# EasyEDA Pro project EasyEDApro.epro

# Schematic Main board
Create Date: 2023-11-24; Page Name: Sheet_1.1; Project Name: Outdoor Air Quality Sensor; Schematic Name: Main board; Update Date: 2023-11-24; Company: Robonomics.network; Drawed: ludovich88; Page Size: A3; Part Number: RN-AQ - 01; Reviewed: EnsRationis; Version: V1
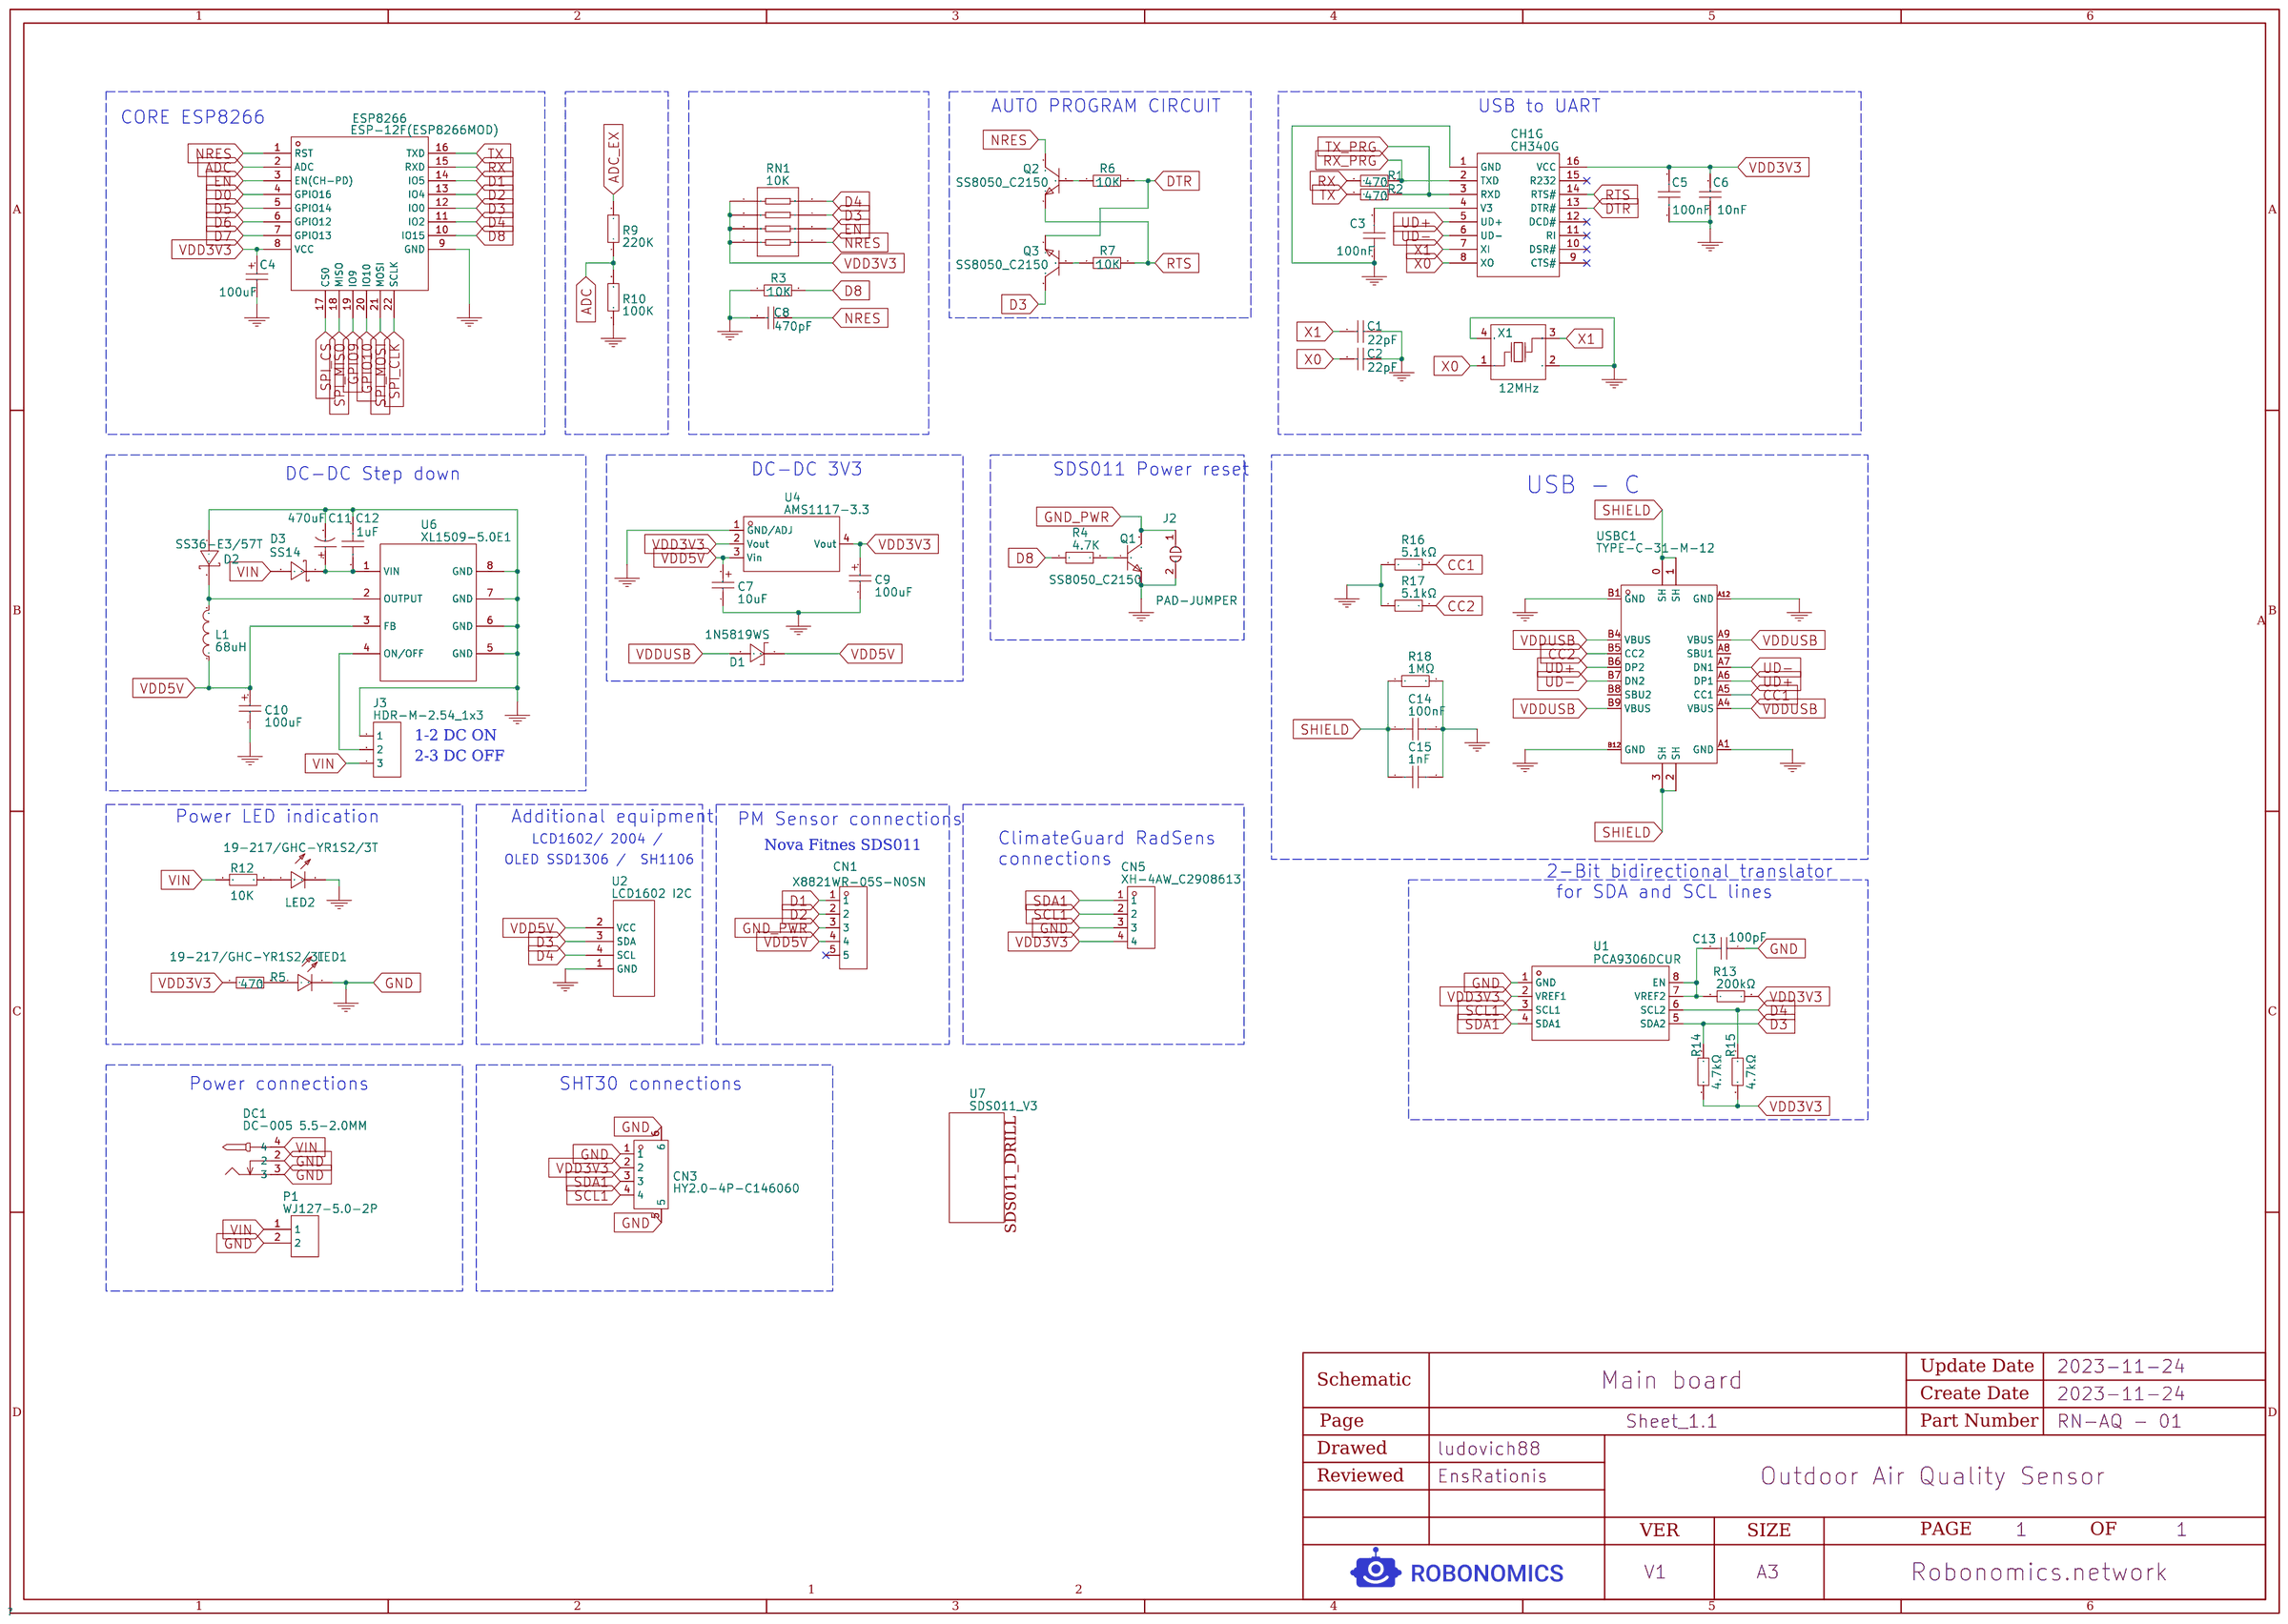
[diagram p0: schematic sheet]

## Parts
C1  22pF  [C0603]
C2  22pF  [C0603]
C3  100nF  [C0603]
C4  100uF  [CAP-SMD_L3.5-W2.8]
C5  100nF  [C0603]
C6  10nF  [C0603]
C7  10uF  [CAP-SMD_L3.2-W1.6-R-RD]
C8  470pF  [C0603]
C9  100uF  [CAP-SMD_L3.5-W2.8]
C10  100uF  [CAP-SMD_L3.5-W2.8]
C11  470uF  [CAP-SMD_BD10.0-L10.3-W10.3-FD]
C12  1uF  [C1206]
C13  100pF  [C0603]
C14  100nF  [C0603]
C15  1nF  [C0603]
CH1G  CH340G  [SOIC-16_150MIL]
CN1  X8821WR-05S-N0SN  [CONN-TH_5P-P2.50_X8821WR-05S-N0SN]
CN3  HY2.0-4P-C146060  [CONN-SMD_HY2.0-4P]
CN5  XH-4AW_C2908613  [CONN-TH_XH-4AW]
D1  1N5819WS  [SOD-323_L1.8-W1.3-LS2.5-RD]
D2  SS36-E3/57T  [SMC_L7.1-W6.2-LS8.1-R-RD]
D3  SS14  [SMA_L4.4-W2.8-LS5.4-RD]
DC1  DC-005 5.5-2.0MM  [DC-IN-TH_DC-5520-1]
ESP8266  ESP-12F(ESP8266MOD)  [WIFIM-SMD_ESP-12F-ESP8266MOD]
J2  PAD-JUMPER  [PAD-JUMPER-2_1]  (no BOM)
J3  HDR-M-2.54_1x3  [HDR-M-2.54_1X3]  (no BOM)
L1  68uH  [IND-SMD_L11.5-W10.0_SMMS1040]
LED1  19-217/GHC-YR1S2/3T  [LED0603-R-RD]
LED2  19-217/GHC-YR1S2/3T  [LED0603-R-RD]
P1  WJ127-5.0-2P  [CONN-TH_2P-P5.00_CPC3703CTR]
Q1  SS8050_C2150  [SOT-23-3_L2.9-W1.3-P1.90-LS2.4-BR]
Q2  SS8050_C2150  [SOT-23-3_L2.9-W1.3-P1.90-LS2.4-BR]
Q3  SS8050_C2150  [SOT-23-3_L2.9-W1.3-P1.90-LS2.4-BR]
R1  470  [R0603]
R2  470  [R0603]
R3  10K  [R0603]
R4  4.7K  [R0603]
R5  470  [R0603]
R6  10K  [R0603]
R7  10K  [R0603]
R9  220K  [R0603]
R10  100K  [R0603]
R12  10K  [R0603]
R13  200kΩ  [R0603]
R14  4.7kΩ  [R0603]
R15  4.7kΩ  [R0603]
R16  5.1kΩ  [R0603]
R17  5.1kΩ  [R0603]
R18  1MΩ  [R0603]
RN1  10K  [RES-ARRAY-SMD_0603-8P-L3.2-W1.6-BL]
U1  PCA9306DCUR  [SSOP-8_L2.0-W2.3-P0.50-LS3.1-BR]
U2  LCD1602 I2C  [LCD1620 I2C]  (no BOM)
U4  AMS1117-3.3  [SOT-223-3_L6.5-W3.4-P2.30-LS7.0-BR]
U6  XL1509-5.0E1  [SOIC-8_L5.0-W4.0-P1.27-LS6.0-BL]
U7  SDS011_V3  [SDS011_V3]  (no BOM)
USBC1  TYPE-C-31-M-12  [USB-C_SMD-TYPE-C-31-M-12]
X1  12MHz  [OSC-SMD_4P-L3.2-W2.5-BL]

## Library data of the parts
C1 C2 = CL10C220JB8NNNC: Supplier: LCSC; Manufacturer: SAMSUNG; Supplier Part: C1653; JLCPCB Part Class: BasicPart
C3 C5 C14 = CC0603KRX7R9BB104: Supplier: LCSC; Manufacturer: YAGEO; Supplier Part: C14663; JLCPCB Part Class: BasicPart
C4 C9 C10 = TAJB107K006RNJ: Supplier: LCSC; Manufacturer: AVX; Supplier Part: C16133; JLCPCB Part Class: BasicPart
C6 = 0603B103K500NT: Supplier: LCSC; Manufacturer: FH; Supplier Part: C57112; JLCPCB Part Class: BasicPart
C7 = CA45-A010M106T: Supplier: LCSC; Manufacturer: Xiangyee; Supplier Part: C127946; JLCPCB Part Class: ExtendedPart
C8 = 0603B471K500NT: Supplier: LCSC; Manufacturer: FH; Supplier Part: C1620; JLCPCB Part Class: BasicPart
C11 = RVT1V471M1010: Supplier: LCSC; Manufacturer: HONOR; Supplier Part: C3350; JLCPCB Part Class: ExtendedPart
C12 = CL31B105KBHNNNE: Supplier: LCSC; Manufacturer: SAMSUNG; Supplier Part: C1848; JLCPCB Part Class: BasicPart
C13 = CL10C101JB8NNNC: Supplier: LCSC; Manufacturer: SAMSUNG; Supplier Part: C14858; JLCPCB Part Class: BasicPart
C15 = GRM1885C1H102FA01D: Supplier: LCSC; Supplier Part: C913702; Manufacturer: muRata(村田); JLCPCB Part Class: ExtendedPart
CH1G = CH340G: Supplier: LCSC; Manufacturer: WCH; image: //image.lceda.cn/szlcsc/C14267.jpg; Supplier Part: C14267; JLCPCB Part Class: Basic
CN1 = X8821WR-05S-N0SN: Supplier: LCSC; Supplier Part: C388742; Manufacturer: XKBConnectivity(中国星坤); JLCPCB Part Class: ExtendedPart
CN3 = HY-4P卧贴: Supplier: LCSC; Supplier Part: C146060; Manufacturer: BOOMELE(博穆精密); JLCPCB Part Class: ExtendedPart
CN5 = XH-4AW: Supplier: LCSC; Supplier Part: C2908613; Manufacturer: HCTL(华灿天禄); JLCPCB Part Class: ExtendedPart
D1 = 1N5819WS: Supplier: LCSC; Supplier Part: C191023; Manufacturer: GuangdongHottech; JLCPCB Part Class: BasicPart
D2 = SS36-E3/57T: Supplier: LCSC; Manufacturer: VISHAY; Supplier Part: C35722; JLCPCB Part Class: BasicPart
D3 = SS14: Supplier: LCSC; Manufacturer: MDD; Supplier Part: C2480; JLCPCB Part Class: BasicPart
DC1 = DC-005 2.0: Supplier: LCSC; Manufacturer: BOOMELE(博穆精密); Manufacturer Part: DC-0052.0; Supplier Part: C16214; JLCPCB Part Class: ExtendedPart
ESP8266 = ESP-12F(ESP8266MOD): Supplier: LCSC; Manufacturer: Ai-Thinker; Supplier Part: C82891
J2 = PAD-JUMPER
J3 = HDR-M-2.54_1x3: Supplier Part: C180248; Supplier: LCSC
L1 = SMMS1040-680MT: Supplier: LCSC; Supplier Part: C286354; Manufacturer: ShunXiangConnaughtElec; JLCPCB Part Class: ExtendedPart
LED1 LED2 = 19-217/GHC-YR1S2/3T: Supplier: LCSC; Manufacturer: EVERLIGHT; Supplier Part: C72043; JLCPCB Part Class: BasicPart
P1 = WJ127-5.0-2P: Supplier: LCSC; Manufacturer: KANGNEX(康奈克斯电气); Supplier Part: C3703; JLCPCB Part Class: ExtendedPart
Q1-Q3 = SS8050: Supplier: LCSC; Manufacturer: CJ; Supplier Part: C2150; JLCPCB Part Class: BasicPart
R1 R2 R5 = 0603WAF4700T5E: Supplier: LCSC; Manufacturer: UniOhm; Supplier Part: C23179; JLCPCB Part Class: BasicPart
R3 R6 R7 R12 = 0603WAF1002T5E: Supplier: LCSC; Manufacturer: UniOhm; Supplier Part: C25804; JLCPCB Part Class: BasicPart
R4 R14 R15 = 0603WAF4701T5E: Supplier: LCSC; Manufacturer: UniOhm; Supplier Part: C23162; JLCPCB Part Class: BasicPart
R9 = 0603WAF2203T5E: Supplier: LCSC; Manufacturer: UniOhm; Supplier Part: C22961; JLCPCB Part Class: BasicPart
R10 = 0603WAF1003T5E: Supplier: LCSC; Manufacturer: UniOhm; Supplier Part: C25803; JLCPCB Part Class: BasicPart
R13 = 0603WAF2003T5E: Supplier: LCSC; Manufacturer: UniOhm; Supplier Part: C25811; Resistance: 200K; JLCPCB Part Class: BasicPart
R16 R17 = 0603WAF5101T5E: Supplier: LCSC; Manufacturer: UNI-ROYAL(厚声); Supplier Part: C23186; Resistance: 5.1K; JLCPCB Part Class: BasicPart
R18 = 0603WAF1004T5E: Supplier: LCSC; Manufacturer: UNI-ROYAL(厚声); Supplier Part: C22935; Resistance: 1M; JLCPCB Part Class: BasicPart
RN1 = 4D03WGJ0103T5E: Supplier: LCSC; Manufacturer: UniOhm; Supplier Part: C29718; JLCPCB Part Class: BasicPart
U1 = PCA9306DCUR: Supplier: LCSC; Manufacturer: TI; Supplier Part: C33196; JLCPCB Part Class: ExtendedPart
U2 = LCD1602 I2C: Manufacturer Part: LCD1602I2C
U4 = AMS1117-3.3: Supplier: LCSC; Manufacturer: AMS; Supplier Part: C6186; JLCPCB Part Class: BasicPart
U6 = XL1509-5.0E1: Supplier: LCSC; Manufacturer: XLSEMI; Supplier Part: C61063; JLCPCB Part Class: BasicPart
U7 = SDS011_V3
USBC1 = KH-TYPE-C-16P: Supplier: LCSC; Supplier Part: C709357; Manufacturer: kinghelm(金航标); JLCPCB Part Class: ExtendedPart
X1 = X322512MSB4SI: Supplier: LCSC; Manufacturer: YXC; Supplier Part: C9002; JLCPCB Part Class: BasicPart

## Nets
GND: C1.1 C2.1 C3.1 C4.2 C5.1 C6.1 C7.1 C8.1 C9.2 C10.2 C11.2 C12.2 C13.1 C14.2 C15.2 CH1G.1(GND) CN3.1 CN3.5 CN3.6 CN5.3 D2.1(A) DC1.2 DC1.3 ESP8266.9(GND) J2.2(B) J3.1 LED1.2(C) LED2.2(C) P1.2 Q1.2(E) R3.1 R10.1 R16.1 R17.1 R18.2 U1.1(GND) U2.1(GND) U4.1(GND/ADJ) U6.5(GND) U6.6(GND) U6.7(GND) U6.8(GND) USBC1.A1(GND) USBC1.A12(GND) USBC1.B1(GND) USBC1.B12(GND) X1.2(GND) X1.4(GND)
GND_PWR: CN1.3 J2.1(A) Q1.3(C)
VDD3V3: C4.1 C5.2 C6.2 C9.1 CH1G.16(VCC) CN3.2 CN5.4 ESP8266.8(VCC) R5.1 R13.2 R14.2 R15.2 RN1.1 RN1.2 RN1.3 RN1.4 U1.2(VREF1) U4.2(Vout) U4.4(Vout)
VDD5V: C7.2 C10.1 CN1.4 D1.1(C) L1.1 U2.2(VCC) U4.3(Vin) U6.3(FB)
VDDUSB: D1.2(A) USBC1.A4(VBUS) USBC1.A9(VBUS) USBC1.B4(VBUS) USBC1.B9(VBUS)
VIN: D3.2(A) DC1.4 J3.3 P1.1 R12.1
ADC: ESP8266.2(ADC) R9.1 R10.2
ADC_EX: R9.2
CC1: R16.2 USBC1.A5(CC1)
CC2: R17.2 USBC1.B5(CC2)
D0: ESP8266.4(GPIO16)
D1: CN1.1 ESP8266.14(IO5)
D2: CN1.2 ESP8266.13(IO4)
D3: ESP8266.12(IO0) Q3.3(C) R14.1 RN1.7 U1.5(SDA2) U2.3(SDA)
D4: ESP8266.11(IO2) R15.1 RN1.8 U1.6(SCL2) U2.4(SCL)
D5: ESP8266.5(GPIO14)
D6: ESP8266.6(GPIO12)
D7: ESP8266.7(GPIO13)
D8: ESP8266.10(IO15) R3.2 R4.1
DTR: CH1G.13(DTR#) Q3.2(E) R6.2
EN: ESP8266.3(EN(CH-PD)) RN1.6
GPIO9: ESP8266.19(IO9)
GPIO10: ESP8266.20(IO10)
NRES: C8.2 ESP8266.1(RST) Q2.3(C) RN1.5
RTS: CH1G.14(RTS#) Q2.2(E) R7.2
RX: ESP8266.15(RXD) R1.1
RX_PRG: CH1G.2(TXD) R1.2
SCL1: CN3.4 CN5.2 U1.3(SCL1)
SDA1: CN3.3 CN5.1 U1.4(SDA1)
SHIELD: C14.1 C15.1 R18.1 USBC1.0(SH) USBC1.1(SH) USBC1.2(SH) USBC1.3(SH)
SPI_CLK: ESP8266.22(SCLK)
SPI_CS: ESP8266.17(CS0)
SPI_MISO: ESP8266.18(MISO)
SPI_MOSI: ESP8266.21(MOSI)
TX: ESP8266.16(TXD) R2.1
TX_PRG: CH1G.3(RXD) R2.2
UD+: CH1G.5(UD+) USBC1.A6(DP1) USBC1.B6(DP2)
UD-: CH1G.6(UD-) USBC1.A7(DN1) USBC1.B7(DN2)
X0: C2.2 CH1G.8(XO) X1.1(OSC1)
X1: C1.2 CH1G.7(XI) X1.3(OSC2)
$1N258: Q3.1(B) R7.1
$1N259: Q2.1(B) R6.1
$1N402: D2.2(K) L1.2 U6.2(OUTPUT)
$1N403: C11.1 C12.1 D3.1(K) U6.1(VIN)
$1N416: J3.2 U6.4(ON/OFF)
$1N445: C3.2 CH1G.4(V3)
$1N571: Q1.1(B) R4.2
$1N918: LED2.1(A) R12.2
$1N988: C13.2 R13.1 U1.7(VREF2) U1.8(EN)
$1N1452: LED1.1(A) R5.2

Not connected (* = marked no-connect by the designer): CH1G 9(CTS#)* 10(DSR#)* 11(RI)* 12(DCD#)* 15(R232)*; CN1 5*; USBC1 A8(SBU1) B8(SBU2)

## Notes on the sheet
- AUTO PROGRAM CIRCUIT
- USB to UART
- CORE ESP8266
- DC-DC Step down
- DC-DC 3V3
- SDS011 Power reset
- USB - C
- 1-2 DC ON
- 2-3 DC OFF
- Power LED indication
- Additional equipment
- PM Sensor connections
- ClimateGuard RadSens
  connections
- LCD1602/ 2004 /
- Nova Fitnes SDS011
- OLED SSD1306 /  SH1106
- 2-Bit bidirectional translator
   for SDA and SCL lines
- Power connections
- SHT30 connections

# Board PCB
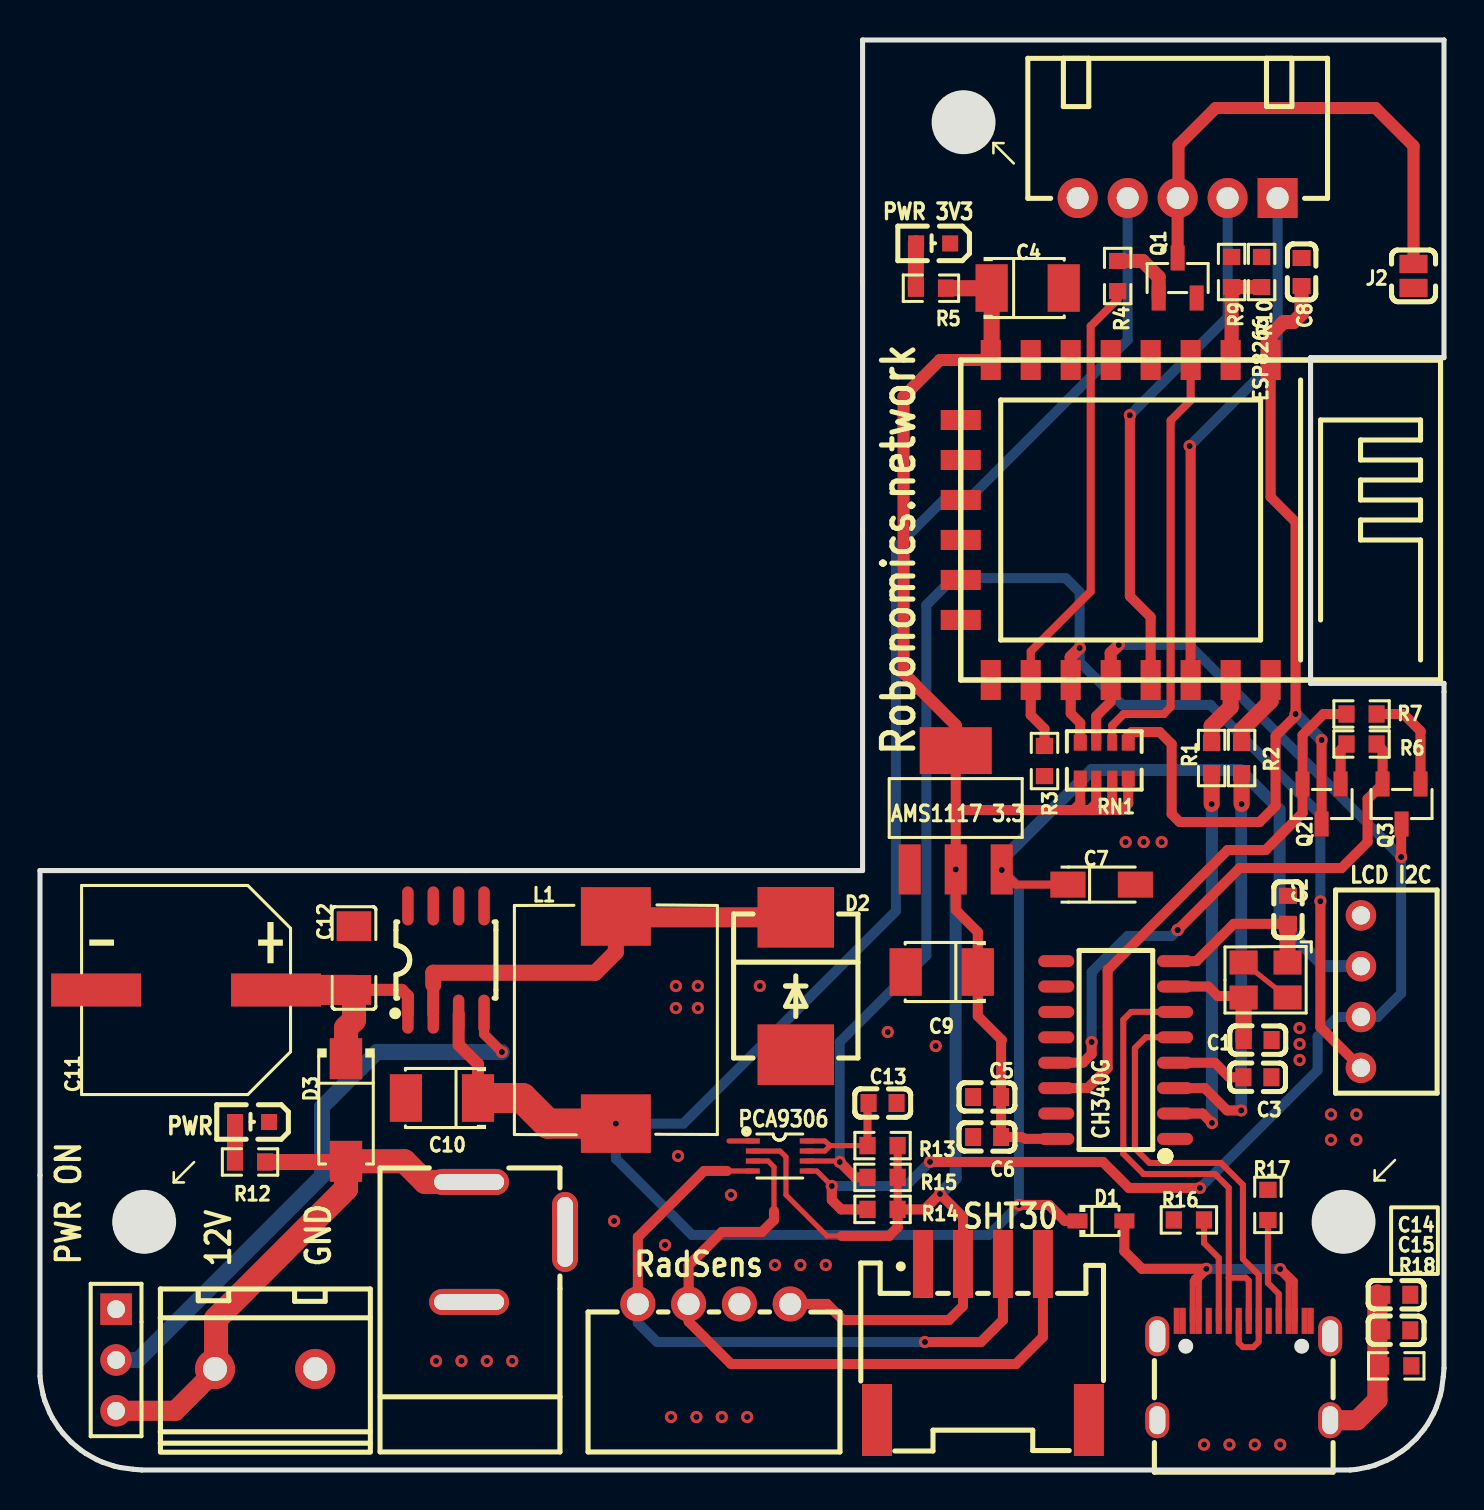
[diagram p1: board, top side]
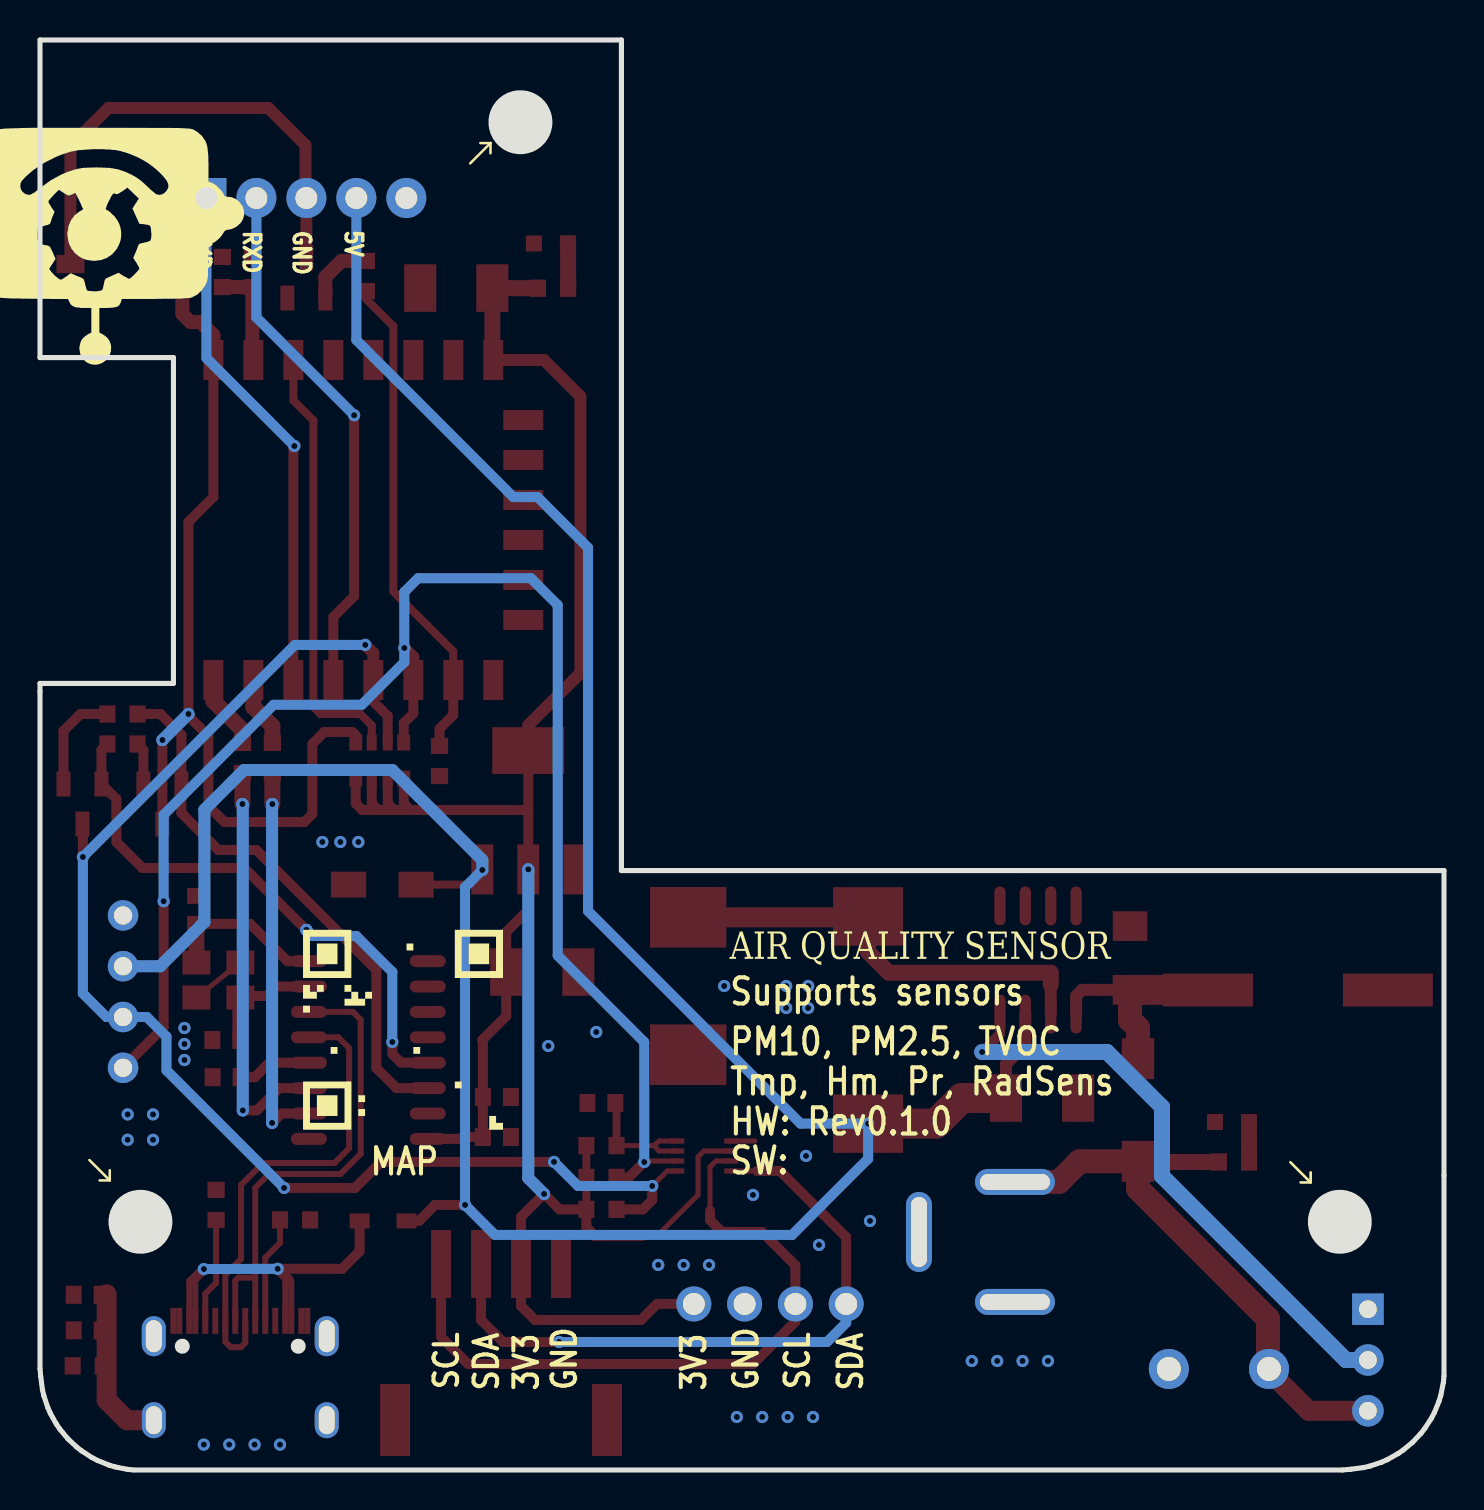
[diagram p2: board, bottom side, seen from below]

Outline 70.23 x 71.5 mm; copper layers: Top Layer, Bottom Layer. Coordinates in mm from the lower left corner of the outline.
Outline path: 0,29.97 0,14.73 0,4.7 0.03,4.38 0.16,3.75 0.25,3.45 0.48,2.87 0.62,2.6 0.96,2.08 1.15,1.84 1.57,1.39 2.04,1 2.3,0.82 2.84,0.52 3.12,0.39 3.71,0.19 4.02,0.12 4.66,0.04 5.08,0 65.53,0 65.85,0.03 66.48,0.16 66.78,0.24 67.36,0.48 67.63,0.62 68.15,0.96 68.4,1.15 68.84,1.57 69.24,2.04 69.41,2.3 69.71,2.83 69.84,3.12 70.04,3.71 70.11,4.02 70.19,4.66 70.23,5.08 70.23,38.92 70.23,39.33 69.82,39.33 63.56,39.33 63.56,55.62 70.23,55.62 70.23,71.5 41.15,71.5 41.15,29.97 0,29.97
Stack: Top Layer 0.035mm / Dielectric1 1.51mm FR4 er 4.5 / Bottom Layer 0.035mm

## Design rules (mm)
template: User Custom Config
spacing Default (default): track to track 0.152, other pairs 0 to 0.152
track width Default (default): min 0.254, default 0.254, max 25.4
differential pair differentialPair (default): width min 0.127, default 0.254, max 2.54; gap min 0.152, default 0.152
via Default (default): diameter min 0.61, default 0.61, max 100.025; hole min 0.305, default 0.305, max 59.995
net GND uses copperRegion1

## Placement (name value [footprint] x y rotation side)
C1  22pF  [C0603]  60.91 21.5 180 top
C2  22pF  [C0603]  62.42 28.01 270 top
C3  100nF  [C0603]  60.9 19.64 180 top
C4  100uF  [CAP-SMD_L3.5-W2.8]  49.41 59.1 180 top
C5  100nF  [C0603]  47.38 18.65 0 top
C6  10nF  [C0603]  47.38 16.65 0 top
C7  10uF  [CAP-SMD_L3.2-W1.6-R-RD]  53.11 29.27 180 top
C8  470pF  [C0603]  63.11 59.9 270 top
C9  100uF  [CAP-SMD_L3.5-W2.8]  45.11 24.9 0 top
C10  100uF  [CAP-SMD_L3.5-W2.8]  20.11 18.6 0 top
C11  470uF  [CAP-SMD_BD10.0-L10.3-W10.3-FD]  7.31 24 180 top
C12  1uF  [C1206]  15.71 25.6 90 top
C13  100pF  [C0603]  42.15 18.35 180 top
C14  100nF  [C0603]  67.84 8.76 0 top
C15  1nF  [C0603]  67.84 6.98 0 top
CH1G  CH340G  [SOIC-16_150MIL]  53.81 21 90 top
CN1  X8821WR-05S-N0SN  [CONN-TH_5P-P2.50_X8821WR-05S-N0SN]  56.91 63.6 180 top
CN3  HY2.0-4P-C146060  [CONN-SMD_HY2.0-4P]  47.17 6.4 0 top
CN5  XH-4AW_C2908613  [CONN-TH_XH-4AW]  33.72 8.3 0 top
D1  1N5819WS  [SOD-323_L1.8-W1.3-LS2.5-RD]  53.07 12.45 0 top
D2  SS36-E3/57T  [SMC_L7.1-W6.2-LS8.1-R-RD]  37.81 24.2 270 top
D3  SS14  [SMA_L4.4-W2.8-LS5.4-RD]  15.31 18 270 top
DC1  DC-005 5.5-2.0MM  [DC-IN-TH_DC-5520-1]  23.86 11.4 90 top
ESP8266  ESP-12F(ESP8266MOD)  [WIFIM-SMD_ESP-12F-ESP8266MOD]  53.81 47.5 270 top
J2  PAD-JUMPER  [PAD-JUMPER-2_1]  68.71 59.7 0 top
J3  HDR-M-2.54_1x3  [HDR-M-2.54_1X3]  3.81 5.5 270 top
L1  68uH  [IND-SMD_L11.5-W10.0_SMMS1040]  28.81 22.5 270 top
LED1  19-217/GHC-YR1S2/3T  [LED0603-R-RD]  44.68 61.33 180 top
LED2  19-217/GHC-YR1S2/3T  [LED0603-R-RD]  10.61 17.4 180 top
P1  WJ127-5.0-2P  [CONN-TH_2P-P5.00_CPC3703CTR]  11.26 5.05 0 top
Q1  SS8050_C2150  [SOT-23-3_L2.9-W1.3-P1.90-LS2.4-BR]  56.91 59.6 270 top
Q2  SS8050_C2150  [SOT-23-3_L2.9-W1.3-P1.90-LS2.4-BR]  64.11 33.3 90 top
Q3  SS8050_C2150  [SOT-23-3_L2.9-W1.3-P1.90-LS2.4-BR]  68.11 33.3 90 top
R1  470  [R0603]  58.61 35.6 270 top
R2  470  [R0603]  60.11 35.6 270 top
R3  10K  [R0603]  50.25 35.45 90 top
R4  4.7K  [R0603]  53.91 59.7 90 top
R5  470  [R0603]  44.57 59.09 180 top
R6  10K  [R0603]  66.11 36.3 0 top
R7  10K  [R0603]  66.11 37.8 180 top
R9  220K  [R0603]  59.61 59.9 90 top
R10  100K  [R0603]  61.11 59.9 270 top
R12  10K  [R0603]  10.51 15.4 180 top
R13  200kΩ  [R0603]  42.15 16.22 0 top
R14  4.7kΩ  [R0603]  42.15 13.03 0 top
R15  4.7kΩ  [R0603]  42.15 14.63 0 top
R16  5.1kΩ  [R0603]  57.47 12.5 0 top
R17  5.1kΩ  [R0603]  61.42 13.25 270 top
R18  1MΩ  [R0603]  67.84 5.21 0 top
RN1  10K  [RES-ARRAY-SMD_0603-8P-L3.2-W1.6-BL]  53.24 35.47 0 top
U1  PCA9306DCUR  [SSOP-8_L2.0-W2.3-P0.50-LS3.1-BR]  37.01 15.7 180 top
U2  LCD1602 I2C  [LCD1620 I2C]  64.81 29 0 top
U4  AMS1117-3.3  [SOT-223-3_L6.5-W3.4-P2.30-LS7.0-BR]  45.81 33 270 top
U6  XL1509-5.0E1  [SOIC-8_L5.0-W4.0-P1.27-LS6.0-BL]  20.31 25.5 0 top
U7  -  [SDS011_V3]  39.81 34 90 top
USBC1  TYPE-C-31-M-12  [USB-C_SMD-TYPE-C-31-M-12]  60.21 4.97 0 top
X1  12MHz  [OSC-SMD_4P-L3.2-W2.5-BL]  61.31 24.5 180 top

## Footprints (pads in the part's own frame, mm; a bottom-side part is the same pattern mirrored in y, then rotated)
C0603
  rect 0.8x0.9 smd: 1(-0.7,0) 2(0.7,0)
C1206
  rect 1.485x1.728 smd: 1(-1.593,0) 2(1.593,0)
CAP-SMD_BD10.0-L10.3-W10.3-FD
  rect 4.5x1.65 smd: 1(-4.5,0) 2(4.5,0)
CAP-SMD_L3.2-W1.6-R-RD
  rect 1.758x1.296 smd: 1(-1.687,0) 2(1.687,0)
CAP-SMD_L3.5-W2.8
  rect 1.607x2.376 smd: 1(1.804,0) 2(-1.804,0)
CONN-SMD_HY2.0-4P
  rect 1x3.4 smd: 1(-3,3.9) 2(-1,3.9) 3(1,3.9) 4(3,3.9)
  rect 1.5x3.6 smd: 5(5.3,-3.9) 6(-5.3,-3.9)
CONN-TH_2P-P5.00_CPC3703CTR
  round 2 hole 1.2: 1(-2.505,0) 2(2.505,0)
CONN-TH_5P-P2.50_X8821WR-05S-N0SN
  rect 2x2 hole 1.1: 1(-5,0)
  round 2 hole 1.1: 2(-2.5,0) 3(0,0) 4(2.5,0) 5(5,0)
CONN-TH_XH-4AW
  round 1.75 hole 1.1: 1(-3.81,0) 2(-1.27,0) 3(1.27,0) 4(3.81,0)
DC-IN-TH_DC-5520-1
  oval 4x1.3 hole 3.5x0.8: 2(0.5,-2.4)
  oval 1.3x4 hole 0.8x3.5: 3(-3,2.4) 4(3,2.4)
HDR-M-2.54_1X3
  rect 1.575x1.575 hole 0.889: 1(-2.54,0)
  round 1.575 hole 0.889: 2(0,0) 3(2.54,0)
IND-SMD_L11.5-W10.0_SMMS1040
  rect 2.924x3.5 smd: 1(5.181,0) 2(-5.18,0)
LCD1620 I2C
  round 1.524 hole 0.914: 1(1.27,-1.27) 2(1.27,-3.81) 3(1.27,-6.35) 4(1.27,-8.89)
LED0603-R-RD
  rect 0.8x0.8 smd: 1(0.851,0) 2(-0.851,0)
OSC-SMD_4P-L3.2-W2.5-BL
  rect 1.4x1.2 smd: 1(-1.1,-0.875) 2(1.1,-0.875) 3(1.1,0.875) 4(-1.1,0.875)
PAD-JUMPER-2_1
  rect 1.4x0.914 smd: 1(0,0.6) 2(0,-0.6)
R0603
  rect 0.806x0.864 smd: 1(-0.753,0) 2(0.753,0)
RES-ARRAY-SMD_0603-8P-L3.2-W1.6-BL
  rect 0.65x0.8 smd: 1(-1.2,-0.9) 4(1.2,-0.9) 5(1.2,0.9) 8(-1.2,0.9)
  rect 0.5x0.8 smd: 2(-0.4,-0.9) 3(0.4,-0.9) 6(0.4,0.9) 7(-0.4,0.9)
SMA_L4.4-W2.8-LS5.4-RD
  rect 2.046x1.62 smd: 1(-2.566,0) 2(2.566,0)
SMC_L7.1-W6.2-LS8.1-R-RD
  rect 3.03x3.82 smd: 1(3.435,0) 2(-3.435,0)
SOD-323_L1.8-W1.3-LS2.5-RD
  rect 1x0.75 smd: 1(-1.173,0) 2(1.173,0)
SOIC-8_L5.0-W4.0-P1.27-LS6.0-BL
  oval 0.569x1.95 smd: 1(-1.905,-2.705) 2(-0.635,-2.705) 3(0.635,-2.705) 4(1.905,-2.705) 5(1.905,2.705) 6(0.635,2.705) 7(-0.635,2.705) 8(-1.905,2.705)
SOIC-16_150MIL
  oval 0.6x1.8 smd: 1(-4.445,-2.972) 2(-3.175,-2.972) 3(-1.905,-2.972) 4(-0.635,-2.972) 5(0.635,-2.972) 6(1.905,-2.972) 7(3.175,-2.972) 8(4.445,-2.972) 9(4.445,2.972) 10(3.175,2.972) 11(1.905,2.972) 12(0.635,2.972) 13(-0.635,2.972) 14(-1.905,2.972) 15(-3.175,2.972) 16(-4.445,2.972)
SOT-23-3_L2.9-W1.3-P1.90-LS2.4-BR
  rect 1.25x0.7 smd: 1(1,-0.95) 2(1,0.95) 3(-1,0)
SOT-223-3_L6.5-W3.4-P2.30-LS7.0-BR
  rect 2.5x1.1 smd: 1(2.97,-2.3) 2(2.97,0) 3(2.97,2.3)
  rect 2.34x3.6 smd: 4(-2.97,0)
SSOP-8_L2.0-W2.3-P0.50-LS3.1-BR
  rect 0.7x0.26 smd: 1(1.35,-0.75) 2(1.35,-0.25) 3(1.35,0.25) 4(1.35,0.75) 5(-1.35,0.75) 6(-1.35,0.25) 7(-1.35,-0.25) 8(-1.35,-0.75)
USB-C_SMD-TYPE-C-31-M-12
  oval 1.2x2 hole 0.8x1.6: 0(-4.325,1.716) 1(4.325,1.716)
  oval 1.2x1.8 hole 0.8x1.4: 2(4.325,-2.484) 3(-4.325,-2.484)
  rect 0.3x1.3 smd: A1(-3.35,2.484) A4(-2.55,2.484) A5(-1.25,2.484) A6(-0.25,2.484) A7(0.25,2.484) A8(1.25,2.484) A9(2.55,2.484) A12(3.35,2.484) B1(3.05,2.484) B4(2.25,2.484) B5(1.75,2.484) B6(0.75,2.484) B7(-0.75,2.484) B8(-1.75,2.484) B9(-2.25,2.484) B12(-3.05,2.484)
WIFIM-SMD_ESP-12F-ESP8266MOD
  rect 2x1 smd: 1(-8.002,7.75) 2(-8.002,5.75) 3(-8.002,3.751) 4(-8.002,1.75) 5(-8.002,-0.249) 6(-8.002,-2.249) 7(-8.002,-4.25) 8(-8.001,-6.25) 9(7.999,-6.25) 10(8,-4.25) 11(8.002,-2.249) 12(8.001,-0.249) 13(8,1.75) 14(8.001,3.751) 15(8.001,5.75) 16(8.001,7.75)
  rect 1x2 smd: 17(-5,-7.75) 18(-3.002,-7.749) 19(-1.003,-7.75) 20(0.998,-7.75) 21(2.997,-7.75) 22(4.997,-7.75)

## Nets
As in the schematic.

Pads without a net: CH1G 9 10 11 12 15; CN1 5; USBC1 A8 B8

## Via types
v1: diameter 0.61, hole 0.305, Top Layer to Bottom Layer, 64 vias

## Routing (per net, layer and track width the routed paths; a pad name or vN(x,y) marks a point on that pad's centre or on a via; arc(x,y) is an arc through that point)
GND: length 4
  Top Layer w0.254: X1.2 X1.4 ; U1.1 34.47,16.45
  vias: v1(19.81,5.45) v1(21.08,5.45) v1(22.35,5.45) v1(23.62,5.45) v1(28.71,12.45) v1(31.27,11.25) v1(31.57,2.65) v1(31.81,24.2) v1(31.81,23.1) v1(31.92,15.7) v1(32.83,2.65) v1(32.91,24.2) v1(32.91,23.1) v1(34.11,2.65) v1(34.57,13.75) v1(35.38,2.65) v1(36.01,24.2) v1(36.77,10.25) v1(38.04,10.25) v1(39.31,10.25) v1(42.41,21.9) v1(44.81,21.2) v1(54.31,31.4) v1(55.21,31.4) v1(56.11,31.4) v1(58.23,1.27) v1(59.5,1.27) v1(60.77,1.27) v1(62.04,1.27) v1(63.01,22.1) v1(63.01,21.3) v1(63.01,20.5) v1(64.58,17.78) v1(64.58,16.51) v1(65.85,17.78) v1(65.85,16.51)
GND_PWR: length 24.9
  Top Layer w0.6: J2.1 68.71,66.2 66.81,68.1 58.81,68.1 56.95,66.25 56.95,63.69 56.91,63.65 Q1.3
VDD3V3: length 116.7
  Top Layer w0.254: 40.09,11.7 39.37,11.7 37.32,13.75 37.32,15.65 37.02,15.95 35.66,15.95
  Top Layer w0.4: R14.2 R15.2 42.9,16.21
  Top Layer w0.5: 37.53,8.3 39.37,8.3 40.17,7.5 45.47,7.5 46.17,8.2 CN3.2 46.17,12.65 v1(45.02,13.8) 44.24,13.03 R14.2 42.9,12.14 42.47,11.7 40.09,11.7 ; CH1G.16 49.3,16.56 49.08,16.65 C6.2 C5.2 48.08,21.47 48.11,21.5 46.91,22.7 C9.1 46.91,26.9 45.81,28 v1(45.81,30.03) 45.81,33 ; RN1.1 52.04,33.33 51.71,33 ; 53.31,33 52.51,33 ; 53.31,33 53.64,33.33 RN1.3 ; 53.31,33 54.11,33 54.44,33.33 RN1.4 ; 52.51,33 52.84,33.33 RN1.2 ; 52.51,33 45.81,33 ; 45.81,33 45.81,35.97
  Top Layer w0.6: 45.81,35.97 45.81,37.24 43.2,39.85 43.2,53.68 45.02,55.5 47.56,55.5
  Top Layer w0.8: 45.32,59.09 47.59,59.09 C4.1 47.6,55.55 ESP8266.8
  Bottom Layer w0.6: 45.02,13.8 45.81,14.59 v1(45.81,30.03)
VDD5V: length 147.4
  Top Layer w0.4: C7.2 48.84,29.27 v1(48.11,30)
  Top Layer w0.5: 51.9,12.45 51.27,12.45 50.47,13.25 v1(48.97,13.25)
  Top Layer w0.6: 20.94,22.79 20.94,21.27 21.91,20.3 C10.1
  Top Layer w1: U4.3 v1(48.11,30)
  Top Layer w1.5: C10.1 24.13,18.6 25.41,17.32 v1(28.81,17.32)
  Bottom Layer w0.5: v1(48.11,30) 48.97,29.14 v1(48.97,13.25) 47.47,11.75 32.61,11.75 28.81,15.56 v1(28.81,17.32) 32.19,17.32 42.82,27.95 42.82,46.12 45.35,48.65 46.56,48.65 54.41,56.5 CN1.4
  Bottom Layer w0.6: 66.08,25.19 64.22,25.19 62.01,27.4 62.01,33.02 60.03,35 52.61,35 48.11,30.5 v1(48.11,30)
VDDUSB: length 19.9
  Top Layer w0.3: USBC1.B9 57.96,9.45 57.66,9.45 USBC1.A4 ; USBC1.B4 62.46,9.46 62.76,9.46 USBC1.A9
  Top Layer w0.5: 57.82,9.45 57.82,9.53 v1(58.34,10.06) 55.12,10.06 54.24,10.94 D1.2 ; v1(62.03,10.05) 62.62,9.46
  Bottom Layer w0.5: v1(58.34,10.06) v1(62.03,10.05)
VIN: length 29.6
  Top Layer w0.8: D3.2 15.27,15.4 R12.1
  Top Layer w1: J3.3 6.77,2.96 8.81,5
  Top Layer w1.2: D3.2 15.31,14.06 8.81,7.56 8.81,5 ; DC1.4 19.26,14.4 18.23,15.44 15.31,15.44
ADC: length 5.2
  Top Layer w0.7: 61.11,59.15 R9.1 59.61,55.55 ESP8266.2
CC1: length 5.4
  Top Layer w0.3: 58.96,7.45 58.96,10.61 58.23,11.35 R16.2
CC2: length 5.3
  Top Layer w0.3: 61.96,7.45 61.96,8.81 61.42,9.35 R17.2
D1: length 26
  Top Layer w0.5: ESP8266.14 57.56,51.2 v1(57.51,51.2)
  Bottom Layer w0.5: v1(57.51,51.2) 61.91,55.6 CN1.1
D2: length 26.6
  Top Layer w0.5: v1(54.52,52.74) 54.52,43.69 55.56,42.65 ESP8266.13
  Bottom Layer w0.5: v1(54.52,52.74) 59.41,57.63 CN1.2
D3: length 71.1
  Top Layer w0.254: U1.5 38.86,14.95 v1(39.61,14.2)
  Top Layer w0.5: v1(58.02,14.1) 54.47,14.1 53.17,15.4 v1(44.52,15.4) ; RN1.7 52.84,37.7 53.56,38.42 53.56,39.5 ; v1(39.61,14.2) 39.61,13.5 40.08,13.03 R14.1 ; v1(68.09,30.65) 68.09,32.28 Q3.3
  Top Layer w0.6: ESP8266.12 53.56,40.85 v1(53.96,41.26) 53.96,41.25
  Bottom Layer w0.5: 53.96,41.25 57.48,41.25 v1(68.09,30.65) 68.09,23.83 66.91,22.65 64.89,22.65 63.91,21.67 63.91,19.99 v1(58.02,14.1) ; v1(39.61,14.2) 43.32,14.2 v1(44.52,15.4)
D4: length 78.8
  Top Layer w0.254: U1.6 39.96,15.45
  Top Layer w0.5: U2.4 64.05,22.14 v1(64.05,28.44) ; 51.56,39.5 51.56,37.83 52.04,37.35 RN1.8 ; R15.1 40.78,14.63 v1(40.01,15.4)
  Top Layer w0.6: ESP8266.11 51.56,40.65 v1(52.01,41.1)
  Bottom Layer w0.5: v1(64.05,28.44) 64.05,32.76 58.55,38.26 54.14,38.26 52.01,40.39 v1(52.01,41.1) 52.01,43.9 51.32,44.59 45.68,44.59 44.34,43.25 44.34,25.73 40.01,21.4 v1(40.01,15.4)
D8: length 24.8
  Top Layer w0.4: 49.56,39.5 49.56,40.93 52.56,43.93 52.56,57.19 53.91,58.54 R4.1
  Top Layer w0.5: ESP8266.10 49.56,37.75 50.25,37.06 R3.2
DTR: length 27.9
  Top Layer w0.5: 50.84,20.37 52.17,20.37 52.61,20.8 v1(52.61,21.4) ; v1(56.91,27) 60.01,30.1 65.11,30.1 66.41,31.4 66.41,33.55 Q3.2 67.16,36 66.86,36.3
  Bottom Layer w0.5: v1(56.91,27) 56.61,26.7 54.41,26.7 52.61,24.9 v1(52.61,21.4)
EN: length 21.9
  Top Layer w0.4: ESP8266.3 57.56,53.48 56.56,52.48 56.56,38.15 56.21,37.8 54.21,37.8 53.64,37.23 RN1.6
NRES: length 46
  Top Layer w0.5: Q2.3 v1(64.11,36.5) ; ESP8266.1 61.56,48.65 62.81,47.4 v1(62.81,37.8) 62.81,37.7 61.81,36.7 61.81,33.2 61.01,32.4 57.01,32.4 56.61,32.8 56.61,36.3 56.01,36.9 54.61,36.9 54.44,36.73 RN1.5
  Top Layer w0.7: C8.2 63.11,57.8 62.71,57.4 62.21,57.4 61.56,56.75 ESP8266.1
  Bottom Layer w0.6: v1(62.81,37.8) v1(64.11,36.5)
RTS: length 27.4
  Top Layer w0.5: 65.35,37.8 64.21,37.8 63.16,36.75 Q2.2 63.16,32.85 61.31,31 59.41,31 53.41,25 53.41,20.1 52.4,19.1 CH1G.14
RX: length 3.5
  Top Layer w0.8: 58.61,36.35 58.61,37.2 59.56,38.15 59.56,39.5
RX_PRG: length 19.5
  Top Layer w0.5: v1(58.62,17.35) 58.15,17.83 CH1G.2
  Top Layer w0.8: R1.2 v1(58.61,33.3)
  Bottom Layer w0.6: v1(58.62,17.35) 58.62,33.29 v1(58.61,33.3)
SCL1: length 34.7
  Top Layer w0.254: U1.3 36.42,15.45 36.72,15.15 36.72,12.95
  Top Layer w0.5: 50.17,10.3 50.17,6.65 48.82,5.3 34.57,5.3 32.45,7.42 32.45,10.23 34.11,11.9 36.12,11.9 36.72,12.5 36.72,12.95
SDA1: length 33.3
  Top Layer w0.254: U1.4 34.37,14.95
  Top Layer w0.5: CN3.3 48.17,7.5 47.07,6.4 v1(44.27,6.4) ; 34.37,14.95 33.22,14.95 29.91,11.64 ; CN5.1 29.91,11.64
  Bottom Layer w0.5: v1(44.27,6.4) 30.86,6.4 29.91,7.36 29.91,8.3
SHIELD: length 8.1
  Top Layer w1: 66.9,8.79 66.9,3.5 65.89,2.49 64.54,2.49
TX: length 3.7
  Top Layer w0.8: ESP8266.16 61.56,38.45 60.11,37 60.11,36.35
TX_PRG: length 20.6
  Top Layer w0.5: CH1G.3 58.26,19.09 59.38,17.98 v1(60.09,17.98)
  Top Layer w0.8: R2.2 v1(60.11,33.3)
  Bottom Layer w0.6: v1(60.11,33.3) 60.09,33.28 v1(60.09,17.98)
UD+: length 23.9
  Top Layer w0.3: USBC1.A6 59.96,6.35 60.17,6.14 60.69,6.14 60.96,6.41 USBC1.B6 60.96,9.76 60.17,10.55 60.17,14.25 59.07,15.35 55.5,15.35 54.77,16.08 54.77,21.09 55.31,21.64 CH1G.5
UD-: length 25.2
  Top Layer w0.3: 59.46,9.62 USBC1.B7 ; 59.46,9.62 59.46,14.11 58.78,14.8 55.2,14.8 54.19,15.81 54.19,22.52 54.58,22.91 56.78,22.91 ; 59.46,9.62 60.31,9.62 60.46,9.47 USBC1.A7
X0: length 8.4
  Top Layer w0.5: CH1G.8 57.85,25.44 59.71,27.31 C2.2
  Top Layer w0.8: X1.1 62.41,27.29 C2.2
X1: length 5.8
  Top Layer w0.5: CH1G.7 58.43,24.17 58.91,23.7 60.13,23.7 X1.3
  Top Layer w0.8: C1.2 X1.3
$1N258: length 5.2
  Top Layer w0.5: 66.86,37.8 68.21,37.8 69.06,36.95 Q3.1
$1N259: length 2.1
  Top Layer w0.5: Q2.1 65.06,36 R6.1
$1N402: length 22.4
  Top Layer w0.6: 19.67,24.26 19.67,22.79
  Top Layer w0.8: 19.67,24.26 19.67,24.86 27.77,24.86 28.81,25.9 L1.2
  Top Layer w1: L1.2 28.85,27.64 D2.2
$1N403: length 11.2
  Top Layer w0.6: U6.1 18.4,23.7 18.1,24.01 C12.1
  Top Layer w1.2: D3.1 15.31,22.1 15.71,22.5 C12.1
  Top Layer w1.5: C11.1 C12.1
$1N416: length 30
  Top Layer w0.5: v1(23.11,20.9) 22.21,21.8 22.21,22.79
  Bottom Layer w0.8: v1(23.11,20.9) 16.86,20.9 14.11,18.15 14.11,14.7 4.91,5.5 J3.2
$1N445: length 3.7
  Top Layer w0.5: C3.2 59.49,19.64 58.76,20.36 CH1G.4
$1N571: length 3.4
  Top Layer w0.7: Q1.1 55.96,59.65 55.15,60.45 53.91,60.45
$1N918: length 2
  Top Layer w0.8: LED2.1 R12.2
$1N988: length 6.6
  Top Layer w0.254: 39.53,16.22 39.26,16.45 38.36,16.45 ; 39.53,16.22 39.26,15.95 U1.7 ; 39.53,16.22 R13.1
  Top Layer w0.4: R13.1 41.39,18.3 C13.2
$1N1452: length 2.2
  Top Layer w0.8: R5.2 43.81,61.32 LED1.1

## Copper pours and planes (outline as drawn; the poured copper is in the pictures)
GND on Top Layer: -1.84,72.87 -1.84,29.71 -13.35,29.71 -13.35,26.96 -2.09,26.96 -2.09,0.1 -0.74,-1.25 73.38,-1.25 73.38,73.42 -1.24,73.42 -1.79,72.87
GND on Bottom Layer: -0.89,74.04 -0.89,33.51 -12.25,33.61 -12.32,31.06 -1.04,31.21 -1.14,1.28 0.21,-0.07 74.33,-0.07 74.33,74.59 -0.29,74.59 -0.84,74.04

## Text on the board
Bottom Silkscreen Layer: 5V | GND | RXD | TXD | SDA | SCL | 3V3 | Supports sensors | PM10, PM2.5, TVOC | Tmp, Hm, Pr, RadSens | HW: Rev0.1.0 | SW: | MAP | AIR QUALITY SENSOR
Top Silkscreen Layer: PCA9306 | AMS1117 3.3 | CH340G | PWR 3V3 | LCD I2C | PWR | RadSens | SHT30 | PWR ON | 12V | GND | Robonomics.network
